# EAGLE design 8bit_probe_v2 (EAGLE 5.06)
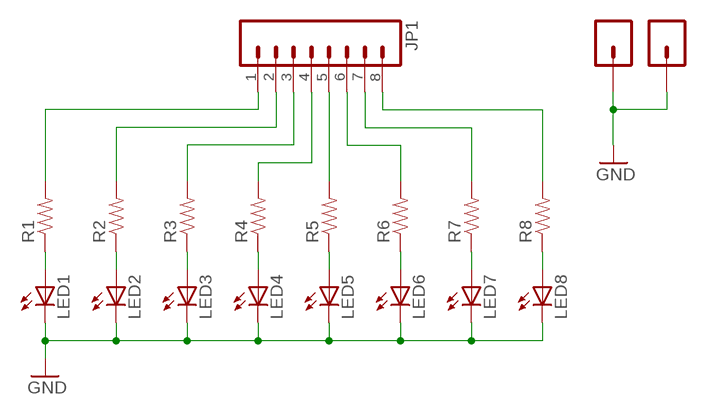
[diagram p0: schematic, sheet 1]

## Parts
GND  M01SMD  [LUXEON-PAD]
JP1  M08  [1X08]
JP3  M01SMD  [LUXEON-PAD]
LED1  LED1206  [LED-1206]
LED2  LED1206  [LED-1206]
LED3  LED1206  [LED-1206]
LED4  LED1206  [LED-1206]
LED5  LED1206  [LED-1206]
LED6  LED1206  [LED-1206]
LED7  LED1206  [LED-1206]
LED8  LED1206  [LED-1206]
R1  RESISTOR  [0805]
R2  RESISTOR  [0805]
R3  RESISTOR  [0805]
R4  RESISTOR  [0805]
R5  RESISTOR  [0805]
R6  RESISTOR  [0805]
R7  RESISTOR  [0805]
R8  RESISTOR  [0805]

## Nets
GND: GND.P$1 JP3.P$1 LED1.C LED2.C LED3.C LED4.C LED5.C LED6.C LED7.C LED8.C
N$1: JP1.5 R5.2
N$2: LED1.A R1.1
N$3: LED2.A R2.1
N$4: LED3.A R3.1
N$5: LED4.A R4.1
N$6: LED5.A R5.1
N$7: LED6.A R6.1
N$8: LED7.A R7.1
N$9: JP1.1 R1.2
N$10: JP1.2 R2.2
N$11: JP1.3 R3.2
N$12: JP1.4 R4.2
N$13: LED8.A R8.1
N$14: JP1.8 R8.2
N$15: JP1.7 R7.2
N$16: JP1.6 R6.2

## Library data of the parts
GND JP3 = SparkFun:M01: Header 1 Standard 1-pin 0.1" header. Use with straight break away headers (SKU : PRT-00116), right angle break away headers (PRT-00553), swiss pins (PRT-00743), machine pins (PRT-00117), and female headers (PRT-00115).
JP1 = SparkFun:M08: Header 8 Standard 8-pin 0.1" header. Use with straight break away headers (SKU : PRT-00116), right angle break away headers (PRT-00553), swiss pins (PRT-00743), machine pins (PRT-00117), and female headers (PRT-00115).
LED1-LED8 = SparkFun:LED: LEDs Standard schematic elements and footprints for 5mm, 3mm, 1206, and 0603 sized LEDs. 5mm - Spark Fun Electronics SKU : COM-00529 (and others)
R1-R8 = SparkFun:RESISTOR: Resistor Basic schematic elements and footprints for 0603, 1206, and PTH 1/10th watt (small) resistors.

## Board
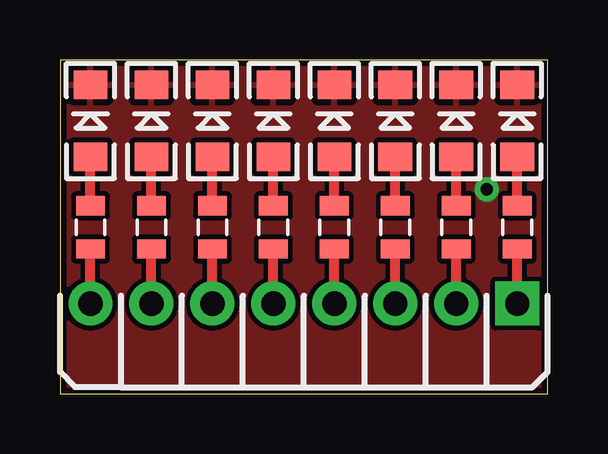
[diagram p1: board, top side]
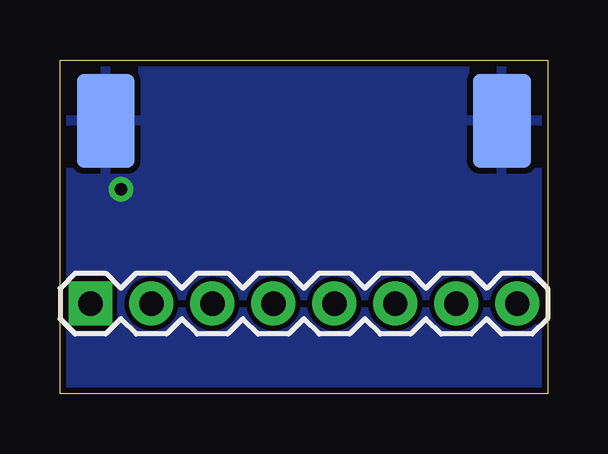
[diagram p2: board, bottom side, seen from below]

Size 20.32 x 13.93 mm. Coordinates in mm from the lower left corner, seen from the top.
Outline: 0,0 20.32,0 20.32,13.93 0,13.93 0,0
Copper layers (1*16): Top 0.035mm / dielectric 1.5mm / Bottom 0.035mm
Design rules "SparkFun": minimum track width 8mil, minimum drill 20mil, track to track 8mil, track to pad 8mil, pad to pad 8mil, via to via 8mil, smd to smd 8mil, copper to edge 10mil, drill to drill 8mil, minimum pad ring 12mil, minimum via ring 10mil, stop-mask expansion 4mil, vias tented up to drill 25mil, thermal gap 10mil

### Footprints (pad centres in the part's own frame; a part is rotated, then mirrored left to right if it is on the bottom)
LUXEON-PAD = smd 3.9 x 2.4: P$1 0,0
1X08 = drill 1.016 pad 1.829 square: 1 0,0 | drill 1.016 pad 1.829 round: 2 2.54,0; 3 5.08,0; 4 7.62,0; 5 10.16,0; 6 12.7,0; 7 15.24,0; 8 17.78,0
LED-1206 = smd 1.2 x 1.4: A -1.5,0; C 1.5,0
0805 = smd 0.8 x 1.2: 1 -0.9,0; 2 0.9,0

### Placement (x,y rotation side)
GND  1.91,11.39 270 bottom
JP1  19.05,3.77 0 bottom
JP3  18.41,11.39 90 bottom
LED1  19.05,11.39 90 top
LED2  16.51,11.39 90 top
LED3  13.97,11.39 90 top
LED4  11.43,11.39 90 top
LED5  8.89,11.39 90 top
LED6  6.35,11.39 90 top
LED7  3.81,11.39 90 top
LED8  1.27,11.39 90 top
R1  19.05,6.95 270 top
R2  16.51,6.95 270 top
R3  13.97,6.95 270 top
R4  11.43,6.95 270 top
R5  8.89,6.95 270 top
R6  6.35,6.95 270 top
R7  3.81,6.95 270 top
R8  1.27,6.95 270 top

### Tracks (layer width: path | path; a pad name or v marks a point on that pad's centre or on a via)
GND  (via drill 0.51)
  other vias: 17.78,8.53
  pour Top (isolate 0.203): 0,13.93 20.32,13.93 20.32,0 0,0
  pour Bottom: 0,13.93 20.32,13.93 20.32,0 0,0
N$1
  Top 0.406: JP1.5 R5.2
N$2
  Top 0.406: R1.1 LED1.A
N$3
  Top 0.406: R2.1 LED2.A
N$4
  Top 0.406: R3.1 LED3.A
N$5
  Top 0.406: R4.1 LED4.A
N$6
  Top 0.406: R5.1 LED5.A
N$7
  Top 0.406: R6.1 LED6.A
N$8
  Top 0.406: R7.1 LED7.A
N$9
  Top 0.406: JP1.1 R1.2
N$10
  Top 0.406: JP1.2 R2.2
N$11
  Top 0.406: JP1.3 R3.2
N$12
  Top 0.406: JP1.4 R4.2
N$13
  Top 0.406: R8.1 LED8.A
N$14
  Top 0.406: JP1.8 R8.2
N$15
  Top 0.406: JP1.7 R7.2
N$16
  Top 0.406: JP1.6 R6.2